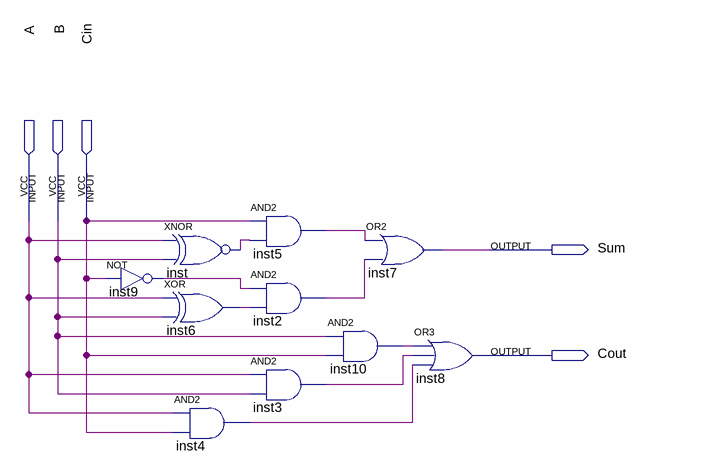
[diagram p0: schematic sheet]
// Quartus schematic SUMA.bdf as structural Verilog: 10 symbols, 5 pins
module SUMA (
  input  A,
  input  B,
  input  Cin,
  output Sum,
  output Cout
);

  wire inst2_out, inst3_out, inst4_out, inst5_out, inst6_out, inst9_out, inst10_out, inst_out;

  xnor inst (inst_out, A, B);
  not inst9 (inst9_out, Cin);
  xor inst6 (inst6_out, A, B);
  and inst4 (inst4_out, A, Cin);
  and inst5 (inst5_out, Cin, inst_out);
  and inst2 (inst2_out, inst9_out, inst6_out);
  and inst3 (inst3_out, A, B);
  and inst10 (inst10_out, B, Cin);
  or inst7 (Sum, inst5_out, inst2_out);
  or inst8 (Cout, inst10_out, inst3_out, inst4_out);
endmodule
